# Altium schematic sheet 03.板载外设 BEEP PNP.SchDoc
size A4; CheckedBy: <审核日期>; CompanyName: 广州致远电子有限公司; DocumentNumber: 3; SheetNumber: 3; SheetTotal: 8; PageSetup: Record=PageOptions|CenterHorizontal=True|CenterVertical=True|PrintScale=1.00|XCorrection=1.00|YCorrection=1.00|PrintKind=0|BorderSize=5000000|LeftOffset=0|BottomOffset=0|Orientation=2|PaperLength=1000|PaperWidth=1000|Scale=100|PaperSource=7|PrintQuality=600|MediaType=1|DitherType=10|PaperKind=A4|PrintScaleMode=1; DesignDate: 20180913; CheckDate: <审核人员>; SheetName: 评估板外设; SheetVersion: V1.01; SheetDescription: 评估板外设; productModel: AML166-Core; productName: AML166
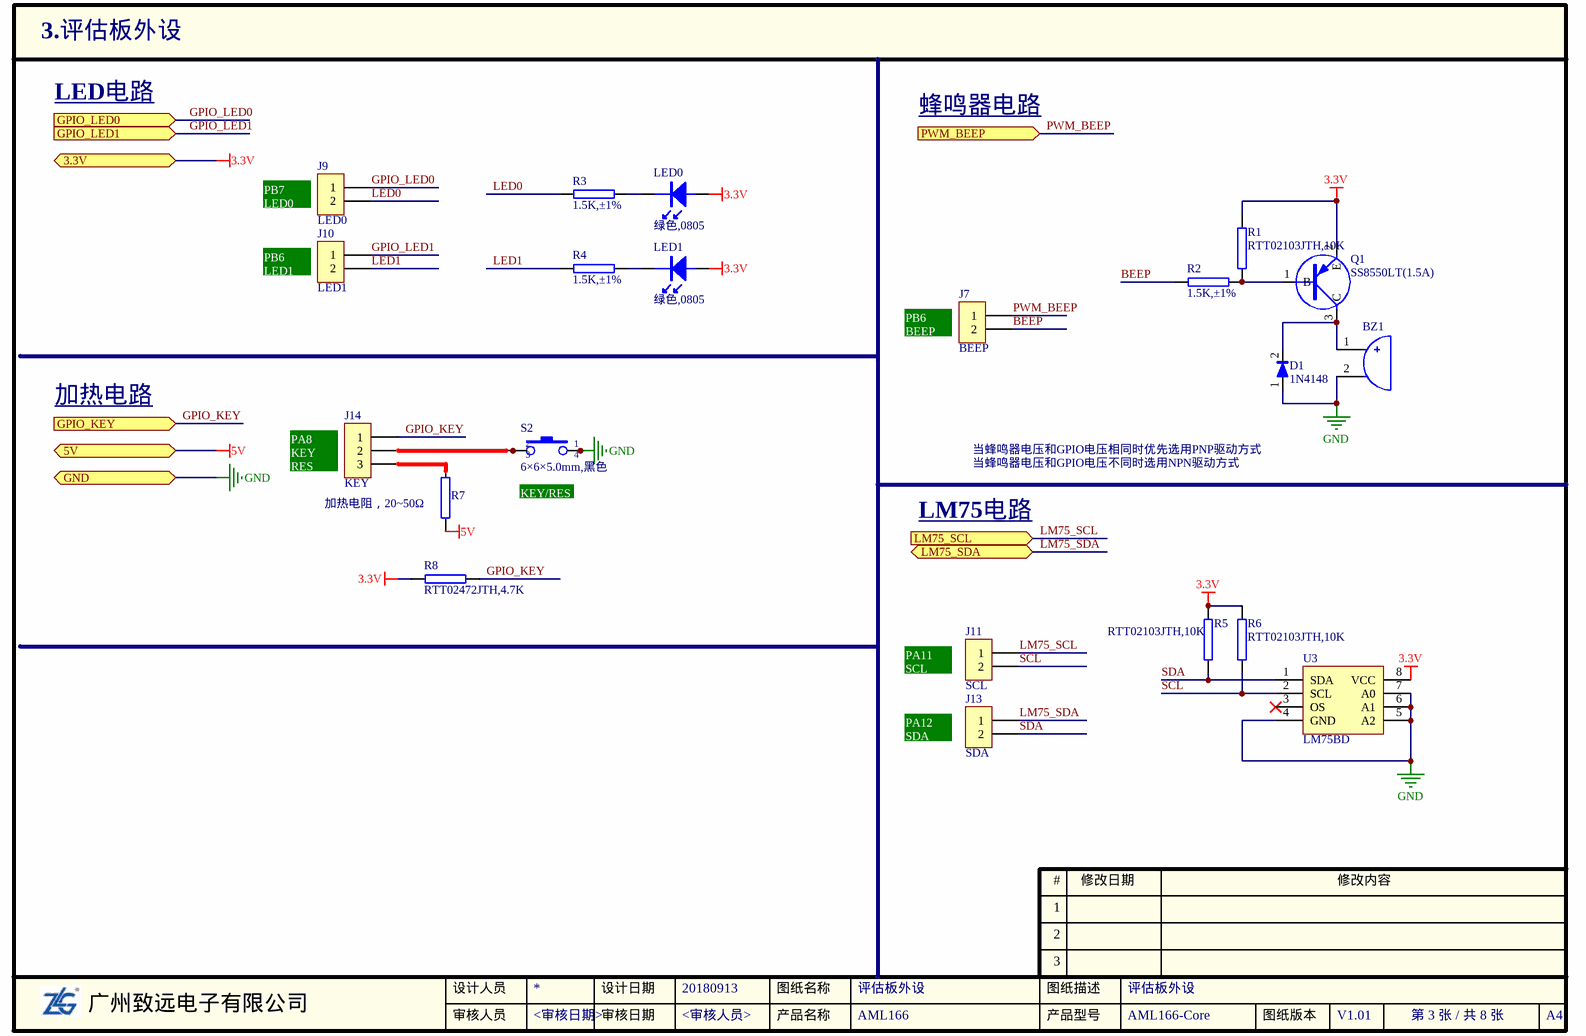
[diagram p0: 03.板载外设 BEEP PNP.SchDoc]

## Parts
BZ1  BUZZER2  [BUZZ-4/9]  (value not drawn)
D1  value 1N4148  [SOD-323]  (hidden comment: DIODE1)
J7  BEEP  [SIP-2-2.54]
J9  LED0  [SIP-2-2.54]
J10  LED1  [SIP-2-2.54]
J11  SCL  [SIP-2-2.54]
J13  SDA  [SIP-2-2.54]
J14  KEY  [SIP-3-2.54]
LED0  value 绿色,0805  [LED-0805]  (hidden comment: LED1)
LED1  value 绿色,0805  [LED-0805]  (hidden comment: LED1)
Q1  value SS8550LT(1.5A)  [SOT-23]  (hidden comment: PNP-1)
R1  RTT02103JTH,10K  [0402R]
R2  1.5K,±1%  [0402R]
R3  1.5K,±1%  [0402R]
R4  1.5K,±1%  [0402R]
R5  RTT02103JTH,10K  [0402R]
R6  RTT02103JTH,10K  [0402R]
R7  20Ω,±5%  [RESAD1778W80L1450D430P]  (value not drawn)
R8  RTT02472JTH,4.7K  [0402R]
S2  value 6×6×5.0mm,黑色  [KEY-6S]  (hidden comment: SW-PB4P)
U3  value LM75BD  [SOIC127P600X175-8N]  (hidden comment: LM75B)

## Ports
3.3V, 5V, GND, GPIO_KEY (in), GPIO_LED0 (in), GPIO_LED1 (in), LM75_SCL (in), LM75_SDA (bidir), PWM_BEEP (in)

## Nets
3.3V: LED0.1 LED1.1 Q1.2(E) R1.2 R5.2 R6.2 R8.1 U3.8(VCC) ; port 3.3V
5V: R7.1 ; port 5V
GND: BZ1.2(B) D1.1 S2.1 S2.4 U3.4(GND) U3.5(A2) U3.6(A1) U3.7(A0) ; port GND
BEEP: J7.2 R2.1
GPIO_KEY: J14.1 R8.2 ; port GPIO_KEY
GPIO_LED0: J9.1 ; port GPIO_LED0
GPIO_LED1: J10.1 ; port GPIO_LED1
LED0: J9.2 R3.2
LED1: J10.2 R4.2
LM75_SCL: J11.1 ; port LM75_SCL
LM75_SDA: J13.1 ; port LM75_SDA
PWM_BEEP: J7.1 ; port PWM_BEEP
SCL: J11.2 R6.1 U3.2(SCL)
SDA: J13.2 R5.1 U3.1(SDA)
NetBZ1_1: BZ1.1(A) D1.2 Q1.3(C)
NetJ14_2: J14.2 S2.2 S2.3
NetJ14_3: J14.3 R7.2
NetLED0_2: LED0.2 R3.1
NetLED1_2: LED1.2 R4.1
NetQ1_1: Q1.1(B) R1.1 R2.2

Not connected (* = marked no-connect by the designer): U3 3(OS)*

## Notes on the sheet
- LED电路
- 蜂鸣器电路
- (near J9) PB7
  LED0
- (near J10) PB6
  LED1
- (near J7) PB6
  BEEP
- 加热电路
- (near J14) PA8
  KEY
  RES
- 加热电阻，20~50Ω
- (near S2) KEY/RES
- LM75电路
- 当蜂鸣器电压和GPIO电压相同时优先选用PNP驱动方式
- 当蜂鸣器电压和GPIO电压不同时选用NPN驱动方式
- PA11
  SCL
- PA12
  SDA
- 1
- #
- 修改日期
- 修改内容
- 2
- 3
- 设计人员
- 审核人员
- 设计日期
- 审核日期
- 产品名称
- 图纸名称
- 产品型号
- 图纸描述
- 图纸版本
- A4

## Library data of the parts
BZ1 = 1.06.09.0016: Buzzer有极性; Value: AS-905I-LF,无源; 名称: 讯响器; 厂商: 常州笠翔; 型号: AS-905I-LF,无源,Ф9×4.8mm; 贴片和直插: THT; PCB备注: Flq-Shcj-Twrj-150113; 器件优选方案: 量产物料,优先选用; 物料代码: 1.06.09.0016; RoHS: RoHS; ComponentLink1Description: ErpDataInfo; ComponentLink1URL: http://erp.zlgmcu.com/ErpExt/ErpData/ListMateriel.aspx?pkey=1.06.09.0016
D1 = 1.04.07.0027: 1N4148,SOD-323,RoHS; 名称: 二极管; 设备封装名称: SOD-323_1N4148; 贴片和直插: SMT; 物料代码: 1.04.07.0027; 封装: SOD-323; RoHS: RoHS; 型号: 1N4148; ComponentLink1Description: ErpDataInfo; ComponentLink1URL: http://erp.zlgmcu.com/ErpExt/ErpData/ListMateriel.aspx?pkey=1.04.07.0027
J7 J9-J11 J13 = CON2: Connector; 物料代码: 1.10.03.0164
J14 = CON3: Connector; 物料代码: 1.10.03.0164
LED0 LED1 = 1.04.05.0002: 绿色,0805,0805,RoHS; 名称: 发光二极管; 封装: 0805; 设备封装名称: LED0805-GREEN; 贴片和直插: SMT; 器件优选方案: 样品物料,谨慎选用; 物料代码: 1.04.05.0002; RoHS: RoHS; 型号: 绿色,0805; ComponentLink1Description: ErpDataInfo; ComponentLink1URL: http://erp.zlgmcu.com/ErpExt/ErpData/ListMateriel.aspx?pkey=1.04.05.0002
Q1 = 1.04.09.0002: PNP Transistor; 名称: 三极管; 设备封装名称: SOT-23_SS8550LT; 厂商: 江苏长电; 贴片和直插: SMT; 物料代码: 1.04.09.0002; 封装: SOT-23; RoHS: RoHS; 型号: SS8550LT(1.5A); ComponentLink1Description: ErpDataInfo; ComponentLink1URL: http://erp.zlgmcu.com/ErpExt/ErpData/ListMateriel.aspx?pkey=1.04.09.0002
R1 R5 R6 = 1.01.17.0006: RTT02103JTH,10K,±5%,0402,RALEC,RoHS; 名称: 电阻; 封装: 0402; 设备封装名称: R0402_10K; 贴片和直插: SMT; 器件优选方案: 正常状态，可以选用; 物料代码: 1.01.17.0006; Value: RTT02103JTH,10K; 厂商: RALEC; RoHS: RoHS; 型号: RTT02103JTH,10K,±5%; ComponentLink1Description: ErpDataInfo; ComponentLink1URL: http://erp.zlgmcu.com/ErpExt/ErpData/ListMateriel.aspx?pkey=1.01.17.0006
R2-R4 = 1.01.17.0011: 1.5K,±1%,0402,RALEC,RoHS; 名称: 电阻; 封装: 0402; 设备封装名称: R0402_1.5K_1%; 贴片和直插: SMT; 器件优选方案: 正常状态，可以选用; 物料代码: 1.01.17.0011; Value: 1.5K,±1%; 厂商: Ralec; RoHS: RoHS; 型号: 1.5K,±1%; ComponentLink1Description: ErpDataInfo; ComponentLink1URL: http://erp.zlgmcu.com/ErpExt/ErpData/ListMateriel.aspx?pkey=1.01.17.0011
R7 = 1.01.10.0003: 20Ω,±5%,2W,Ф5.5×16mm,RoHS; 名称: 电阻; 贴片和直插: THT; 物料代码: 1.01.10.0003; Value: 20Ω,±5%; RoHS: RoHS; 型号: 20Ω,±5%,2W,Ф5.5×16mm; ComponentLink1Description: ErpDataInfo; ComponentLink1URL: http://erp.zlgmcu.com/ErpExt/ErpData/ListMateriel.aspx?pkey=1.01.10.0003
R8 = 1.01.17.0019: RTT02472JTH,4.7K,±5%,0402,RALEC,RoHS; 名称: 电阻; 封装: 0402; 设备封装名称: R0402_4.7K; 贴片和直插: SMT; 器件优选方案: 正常状态，可以选用; 物料代码: 1.01.17.0019; Value: RTT02472JTH,4.7K; 厂商: RALEC; RoHS: RoHS; 型号: RTT02472JTH,4.7K,±5%; ComponentLink1Description: ErpDataInfo; ComponentLink1URL: http://erp.zlgmcu.com/ErpExt/ErpData/ListMateriel.aspx?pkey=1.01.17.0019
S2 = 1.09.01.0003: 6×6×5.0mm,黑色,SMD,,*; 名称: 轻触按键; 贴片和直插: SMT; 物料代码: 1.09.01.0003; 型号: 6×6×5.0mm,黑色,SMD; ComponentLink1Description: ErpDataInfo; ComponentLink1URL: http://erp.zlgmcu.com/ErpExt/ErpData/ListMateriel.aspx?pkey=1.09.01.0003
U3 = 1.05.10.0602: LM75BD,SO-9,NXP,RoHS; 名称: IC; 封装: SO-8; 贴片和直插: SMT; 器件优选方案: 样品物料,谨慎选用; 物料代码: 1.05.10.0602; 厂商: NXP; RoHS: RoHS; 型号: LM75BD; ComponentLink1Description: ErpDataInfo; ComponentLink1URL: http://erp.zlgmcu.com/ErpExt/ErpData/ListMateriel.aspx?pkey=1.05.10.0602